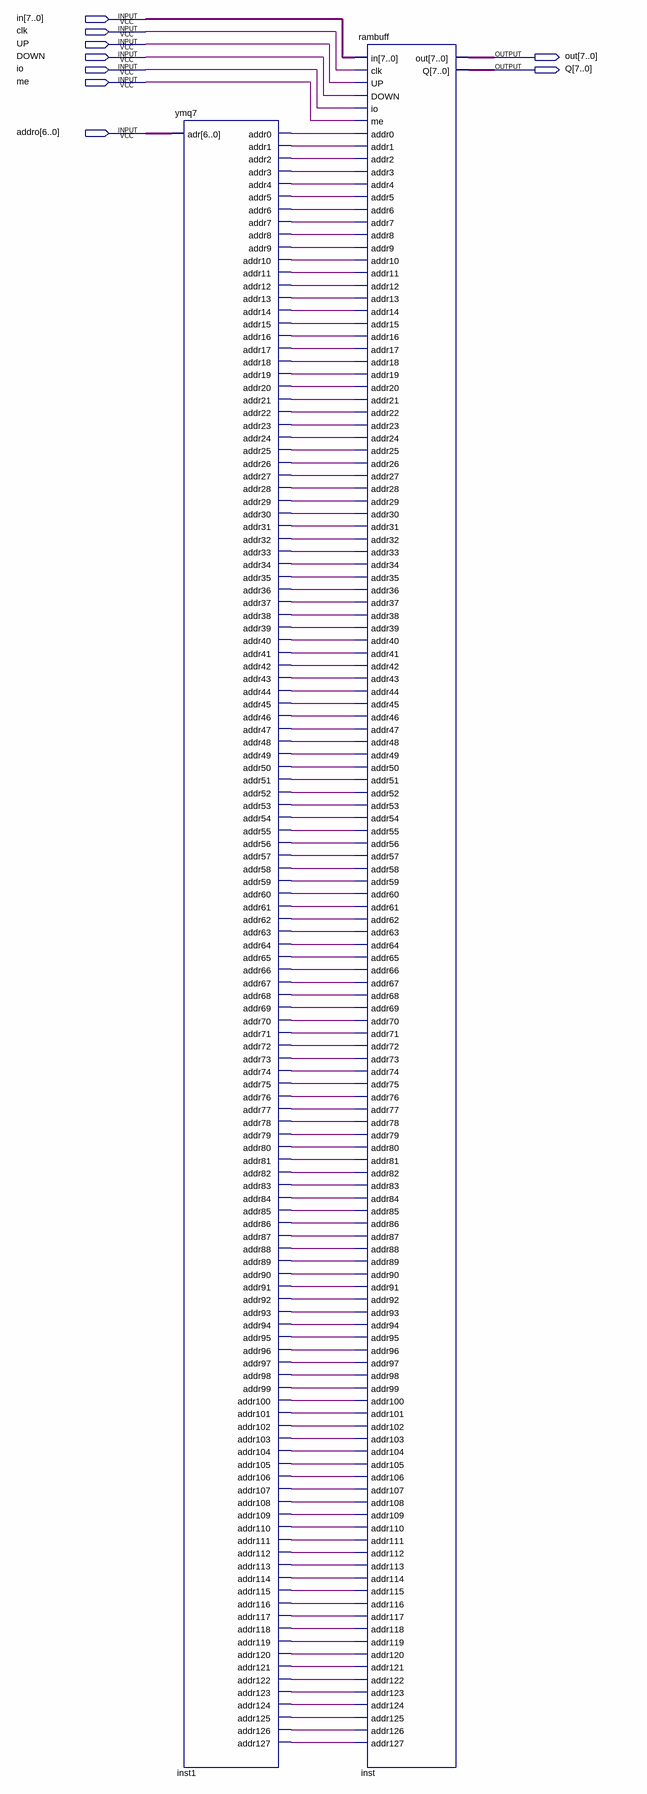
[diagram p0: schematic sheet]
// Quartus schematic buff.bdf as structural Verilog: 2 symbols, 9 pins
module buff (
  input  [7:0] in,
  input  clk,
  input  UP,
  input  DOWN,
  input  io,
  input  me,
  input  [6:0] addro,
  output [7:0] out,
  output [7:0] Q
);

  wire inst1_addr0, inst1_addr1, inst1_addr2, inst1_addr3, inst1_addr4, inst1_addr5, inst1_addr6,
       inst1_addr7, inst1_addr8, inst1_addr9, inst1_addr10, inst1_addr11, inst1_addr12, inst1_addr13,
       inst1_addr14, inst1_addr15, inst1_addr16, inst1_addr17, inst1_addr18, inst1_addr19, inst1_addr20,
       inst1_addr21, inst1_addr22, inst1_addr23, inst1_addr24, inst1_addr25, inst1_addr26, inst1_addr27,
       inst1_addr28, inst1_addr29, inst1_addr30, inst1_addr31, inst1_addr32, inst1_addr33, inst1_addr34,
       inst1_addr35, inst1_addr36, inst1_addr37, inst1_addr38, inst1_addr39, inst1_addr40, inst1_addr41,
       inst1_addr42, inst1_addr43, inst1_addr44, inst1_addr45, inst1_addr46, inst1_addr47, inst1_addr48,
       inst1_addr49, inst1_addr50, inst1_addr51, inst1_addr52, inst1_addr53, inst1_addr54, inst1_addr55,
       inst1_addr56, inst1_addr57, inst1_addr58, inst1_addr59, inst1_addr60, inst1_addr61, inst1_addr62,
       inst1_addr63, inst1_addr64, inst1_addr65, inst1_addr66, inst1_addr67, inst1_addr68, inst1_addr69,
       inst1_addr70, inst1_addr71, inst1_addr72, inst1_addr73, inst1_addr74, inst1_addr75, inst1_addr76,
       inst1_addr77, inst1_addr78, inst1_addr79, inst1_addr80, inst1_addr81, inst1_addr82, inst1_addr83,
       inst1_addr84, inst1_addr85, inst1_addr86, inst1_addr87, inst1_addr88, inst1_addr89, inst1_addr90,
       inst1_addr91, inst1_addr92, inst1_addr93, inst1_addr94, inst1_addr95, inst1_addr96, inst1_addr97,
       inst1_addr98, inst1_addr99, inst1_addr100, inst1_addr101, inst1_addr102, inst1_addr103, inst1_addr104,
       inst1_addr105, inst1_addr106, inst1_addr107, inst1_addr108, inst1_addr109, inst1_addr110,
       inst1_addr111, inst1_addr112, inst1_addr113, inst1_addr114, inst1_addr115, inst1_addr116,
       inst1_addr117, inst1_addr118, inst1_addr119, inst1_addr120, inst1_addr121, inst1_addr122,
       inst1_addr123, inst1_addr124, inst1_addr125, inst1_addr126, inst1_addr127;

  ymq7 inst1 (
    .adr(addro), .addr0(inst1_addr0), .addr1(inst1_addr1), .addr2(inst1_addr2), .addr3(inst1_addr3),
    .addr4(inst1_addr4), .addr5(inst1_addr5), .addr6(inst1_addr6), .addr7(inst1_addr7), .addr8(inst1_addr8),
    .addr9(inst1_addr9), .addr10(inst1_addr10), .addr11(inst1_addr11), .addr12(inst1_addr12),
    .addr13(inst1_addr13), .addr14(inst1_addr14), .addr15(inst1_addr15), .addr16(inst1_addr16),
    .addr17(inst1_addr17), .addr18(inst1_addr18), .addr19(inst1_addr19), .addr20(inst1_addr20),
    .addr21(inst1_addr21), .addr22(inst1_addr22), .addr23(inst1_addr23), .addr24(inst1_addr24),
    .addr25(inst1_addr25), .addr26(inst1_addr26), .addr27(inst1_addr27), .addr28(inst1_addr28),
    .addr29(inst1_addr29), .addr30(inst1_addr30), .addr31(inst1_addr31), .addr32(inst1_addr32),
    .addr33(inst1_addr33), .addr34(inst1_addr34), .addr35(inst1_addr35), .addr36(inst1_addr36),
    .addr37(inst1_addr37), .addr38(inst1_addr38), .addr39(inst1_addr39), .addr40(inst1_addr40),
    .addr41(inst1_addr41), .addr42(inst1_addr42), .addr43(inst1_addr43), .addr44(inst1_addr44),
    .addr45(inst1_addr45), .addr46(inst1_addr46), .addr47(inst1_addr47), .addr48(inst1_addr48),
    .addr49(inst1_addr49), .addr50(inst1_addr50), .addr51(inst1_addr51), .addr52(inst1_addr52),
    .addr53(inst1_addr53), .addr54(inst1_addr54), .addr55(inst1_addr55), .addr56(inst1_addr56),
    .addr57(inst1_addr57), .addr58(inst1_addr58), .addr59(inst1_addr59), .addr60(inst1_addr60),
    .addr61(inst1_addr61), .addr62(inst1_addr62), .addr63(inst1_addr63), .addr64(inst1_addr64),
    .addr65(inst1_addr65), .addr66(inst1_addr66), .addr67(inst1_addr67), .addr68(inst1_addr68),
    .addr69(inst1_addr69), .addr70(inst1_addr70), .addr71(inst1_addr71), .addr72(inst1_addr72),
    .addr73(inst1_addr73), .addr74(inst1_addr74), .addr75(inst1_addr75), .addr76(inst1_addr76),
    .addr77(inst1_addr77), .addr78(inst1_addr78), .addr79(inst1_addr79), .addr80(inst1_addr80),
    .addr81(inst1_addr81), .addr82(inst1_addr82), .addr83(inst1_addr83), .addr84(inst1_addr84),
    .addr85(inst1_addr85), .addr86(inst1_addr86), .addr87(inst1_addr87), .addr88(inst1_addr88),
    .addr89(inst1_addr89), .addr90(inst1_addr90), .addr91(inst1_addr91), .addr92(inst1_addr92),
    .addr93(inst1_addr93), .addr94(inst1_addr94), .addr95(inst1_addr95), .addr96(inst1_addr96),
    .addr97(inst1_addr97), .addr98(inst1_addr98), .addr99(inst1_addr99), .addr100(inst1_addr100),
    .addr101(inst1_addr101), .addr102(inst1_addr102), .addr103(inst1_addr103), .addr104(inst1_addr104),
    .addr105(inst1_addr105), .addr106(inst1_addr106), .addr107(inst1_addr107), .addr108(inst1_addr108),
    .addr109(inst1_addr109), .addr110(inst1_addr110), .addr111(inst1_addr111), .addr112(inst1_addr112),
    .addr113(inst1_addr113), .addr114(inst1_addr114), .addr115(inst1_addr115), .addr116(inst1_addr116),
    .addr117(inst1_addr117), .addr118(inst1_addr118), .addr119(inst1_addr119), .addr120(inst1_addr120),
    .addr121(inst1_addr121), .addr122(inst1_addr122), .addr123(inst1_addr123), .addr124(inst1_addr124),
    .addr125(inst1_addr125), .addr126(inst1_addr126), .addr127(inst1_addr127));
  rambuff inst (
    .in(in), .clk(clk), .UP(UP), .DOWN(DOWN), .io(io), .me(me), .addr0(inst1_addr0), .addr1(inst1_addr1),
    .addr2(inst1_addr2), .addr3(inst1_addr3), .addr4(inst1_addr4), .addr5(inst1_addr5), .addr6(inst1_addr6),
    .addr7(inst1_addr7), .addr8(inst1_addr8), .addr9(inst1_addr9), .addr10(inst1_addr10),
    .addr11(inst1_addr11), .addr12(inst1_addr12), .addr13(inst1_addr13), .addr14(inst1_addr14),
    .addr15(inst1_addr15), .addr16(inst1_addr16), .addr17(inst1_addr17), .addr18(inst1_addr18),
    .addr19(inst1_addr19), .addr20(inst1_addr20), .addr21(inst1_addr21), .addr22(inst1_addr22),
    .addr23(inst1_addr23), .addr24(inst1_addr24), .addr25(inst1_addr25), .addr26(inst1_addr26),
    .addr27(inst1_addr27), .addr28(inst1_addr28), .addr29(inst1_addr29), .addr30(inst1_addr30),
    .addr31(inst1_addr31), .addr32(inst1_addr32), .addr33(inst1_addr33), .addr34(inst1_addr34),
    .addr35(inst1_addr35), .addr36(inst1_addr36), .addr37(inst1_addr37), .addr38(inst1_addr38),
    .addr39(inst1_addr39), .addr40(inst1_addr40), .addr41(inst1_addr41), .addr42(inst1_addr42),
    .addr43(inst1_addr43), .addr44(inst1_addr44), .addr45(inst1_addr45), .addr46(inst1_addr46),
    .addr47(inst1_addr47), .addr48(inst1_addr48), .addr49(inst1_addr49), .addr50(inst1_addr50),
    .addr51(inst1_addr51), .addr52(inst1_addr52), .addr53(inst1_addr53), .addr54(inst1_addr54),
    .addr55(inst1_addr55), .addr56(inst1_addr56), .addr57(inst1_addr57), .addr58(inst1_addr58),
    .addr59(inst1_addr59), .addr60(inst1_addr60), .addr61(inst1_addr61), .addr62(inst1_addr62),
    .addr63(inst1_addr63), .addr64(inst1_addr64), .addr65(inst1_addr65), .addr66(inst1_addr66),
    .addr67(inst1_addr67), .addr68(inst1_addr68), .addr69(inst1_addr69), .addr70(inst1_addr70),
    .addr71(inst1_addr71), .addr72(inst1_addr72), .addr73(inst1_addr73), .addr74(inst1_addr74),
    .addr75(inst1_addr75), .addr76(inst1_addr76), .addr77(inst1_addr77), .addr78(inst1_addr78),
    .addr79(inst1_addr79), .addr80(inst1_addr80), .addr81(inst1_addr81), .addr82(inst1_addr82),
    .addr83(inst1_addr83), .addr84(inst1_addr84), .addr85(inst1_addr85), .addr86(inst1_addr86),
    .addr87(inst1_addr87), .addr88(inst1_addr88), .addr89(inst1_addr89), .addr90(inst1_addr90),
    .addr91(inst1_addr91), .addr92(inst1_addr92), .addr93(inst1_addr93), .addr94(inst1_addr94),
    .addr95(inst1_addr95), .addr96(inst1_addr96), .addr97(inst1_addr97), .addr98(inst1_addr98),
    .addr99(inst1_addr99), .addr100(inst1_addr100), .addr101(inst1_addr101), .addr102(inst1_addr102),
    .addr103(inst1_addr103), .addr104(inst1_addr104), .addr105(inst1_addr105), .addr106(inst1_addr106),
    .addr107(inst1_addr107), .addr108(inst1_addr108), .addr109(inst1_addr109), .addr110(inst1_addr110),
    .addr111(inst1_addr111), .addr112(inst1_addr112), .addr113(inst1_addr113), .addr114(inst1_addr114),
    .addr115(inst1_addr115), .addr116(inst1_addr116), .addr117(inst1_addr117), .addr118(inst1_addr118),
    .addr119(inst1_addr119), .addr120(inst1_addr120), .addr121(inst1_addr121), .addr122(inst1_addr122),
    .addr123(inst1_addr123), .addr124(inst1_addr124), .addr125(inst1_addr125), .addr126(inst1_addr126),
    .addr127(inst1_addr127), .out(out), .Q(Q));
endmodule
